# EAGLE design EP2 (EAGLE 9.0.1)
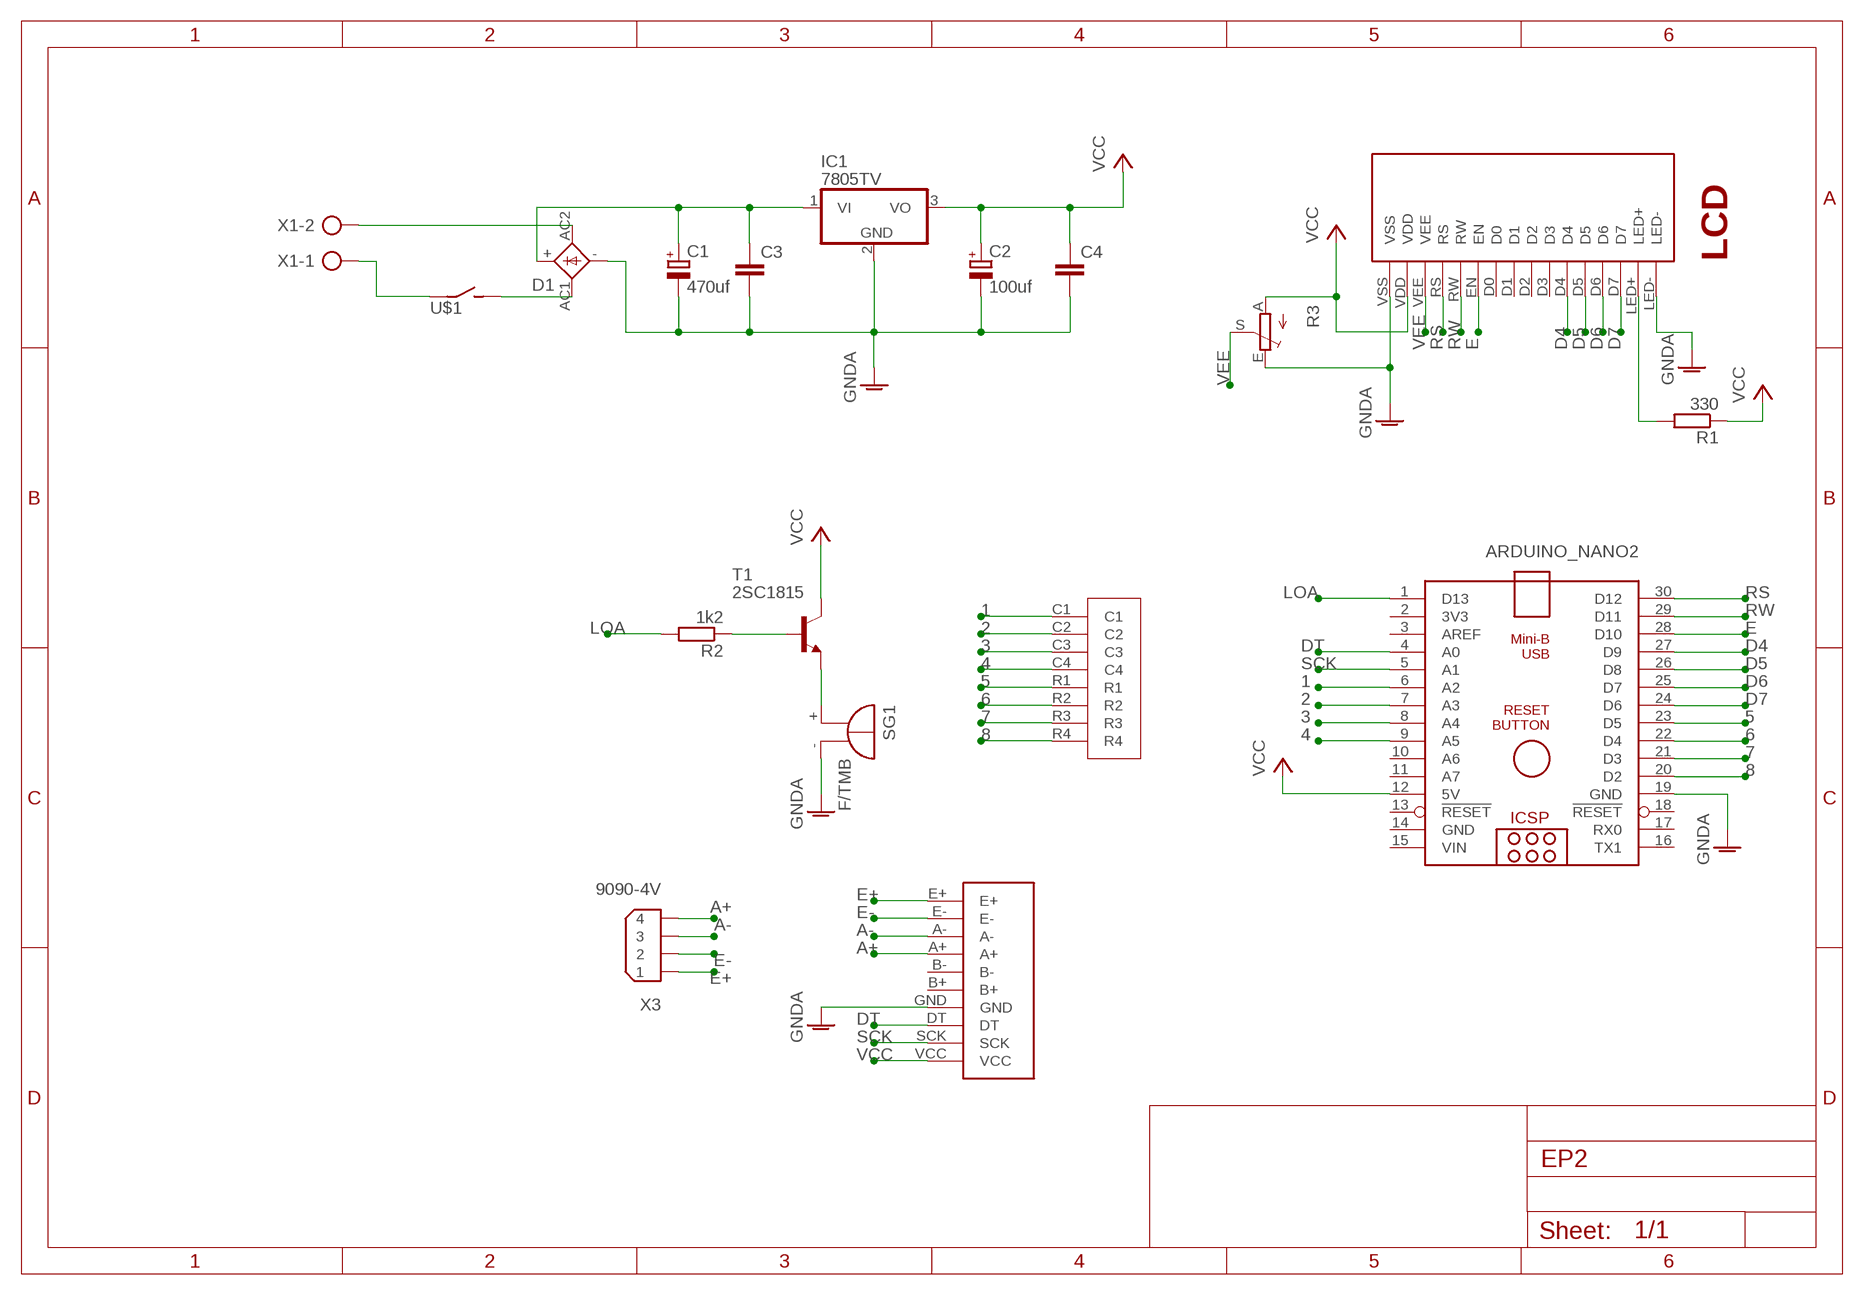
[diagram p0: schematic, sheet 1]

## Parts
ARDUINO_NANO2  ARDUINO_NANO  [ARDUINO_NANO]
C1  470uf  CPOL-EUE3.5-8  [E3,5-8]
C2  100uf  CPOL-EUE2-5  [E2-5]
C3  C-EU025-024X044  [C025-024X044]
C4  C-EU025-024X044  [C025-024X044]
D1  2KBP  [2KBP]
IC1  7805TV  [TO220V]
LCD  LCD20X4  [LCD20X4]
M1  MACHMAUXANH  [MACHMAUXANH]
R1  330  R-EU_0207/10  [0207/10]
R2  1k2  R-EU_0207/10  [0207/10]
R3  TRIM_EU-S64W  [S64W]
SG1  F/TMB  [F/TMB]
T1  2SC1815  [TO92-ECB]
U$1  CONG_TAC  [CONG_TAC]
U$2  MA_TRAN_PHIM  [MA_TRAN_PHIM]
X1  AK300/2  [AK300/2]
X3  9090-4V  [9090-4V]

## Nets
1: ARDUINO_NANO2.6(A2) U$2.C1
2: ARDUINO_NANO2.7(A3) U$2.C2
3: ARDUINO_NANO2.8(A4) U$2.C3
4: ARDUINO_NANO2.9(A5) U$2.C4
5: ARDUINO_NANO2.23(D5) U$2.R1
6: ARDUINO_NANO2.22(D4) U$2.R2
7: ARDUINO_NANO2.21(D3) U$2.R3
8: ARDUINO_NANO2.20(D2) U$2.R4
A+: M1.A+ X3.4
A-: M1.A- X3.3
D4: ARDUINO_NANO2.27(D9) LCD.D4
D5: ARDUINO_NANO2.26(D8) LCD.D5
D6: ARDUINO_NANO2.25(D7) LCD.D6
D7: ARDUINO_NANO2.24(D6) LCD.D7
DT: ARDUINO_NANO2.4(A0) M1.DT
E: ARDUINO_NANO2.28(D10) LCD.EN
E+: M1.E+ X3.1
E-: M1.E- X3.2
GNDA: ARDUINO_NANO2.19(GND) C1.- C2.- C3.2 C4.2 D1.- IC1.2(GND) LCD.LED- LCD.VSS M1.GND R3.E SG1.-
LOA: ARDUINO_NANO2.1(D13) R2.2
N$1: R2.1 T1.B
N$2: D1.AC2 X1.2
N$3: D1.AC1 U$1.P$2
N$4: C1.+ C3.1 D1.+ IC1.1(VI)
N$6: LCD.LED+ R1.2
N$9: SG1.+ T1.E
N$14: U$1.P$1 X1.1
RS: ARDUINO_NANO2.30(D12) LCD.RS
RW: ARDUINO_NANO2.29(D11) LCD.RW
SCK: ARDUINO_NANO2.5(A1) M1.SCK
VCC: ARDUINO_NANO2.12(5V) C2.+ C4.1 IC1.3(VO) LCD.VDD M1.VCC R1.1 R3.A T1.C
VEE: LCD.VEE R3.S
Unconnected: ARDUINO_NANO2.2(3V3) ARDUINO_NANO2.3(AREF) ARDUINO_NANO2.10(A6) ARDUINO_NANO2.11(A7) ARDUINO_NANO2.13(!RESET) ARDUINO_NANO2.16(TX1) ARDUINO_NANO2.17(RX0) ARDUINO_NANO2.18(!RESET) LCD.D0 LCD.D1 LCD.D2 LCD.D3 M1.B+ M1.B-

## Power pins joined to a net without a drawn wire
GND: ARDUINO_NANO2.14(GND)
VIN: ARDUINO_NANO2.15(VIN)

## Library data of the parts
ARDUINO_NANO2 = ArduinoNanoV30:ARDUINO_NANO: Arduino Nano V3.0 Overview: The Arduino Nano is a small, complete, and breadboard-friendly board based on the ATmega328 (Arduino Nano 3.x) or ATmega168 (Arduino Nano 2.x). It has more or less the same functionality of the Arduino Duemilanove, but in a different package. It lacks only a DC power jack, and works with a Mini-B USB cable instead of a standard one. The Nano was designed and is being produced by Gravitech. Specifications: Microcontroller Atmel ATmega168 or ATmega328 Operating Voltage (logic level) 5 V Input Voltage (recommended) 7-12 V Input Voltage (limits) 6-20 V Digital I/O Pins 14 (of which 6 provide PWM output) Analog Input Pins 8 DC Current per I/O Pin 40 mA Flash Memory 16 KB (ATmega168) or 32 KB (ATmega328) of which 2 KB used by bootloader SRAM 1 KB (ATmega168) or 2 KB (ATmega328) EEPROM 512 bytes (ATmega168) or 1 KB (ATmega328) Clock Speed 16 MHz Dimensions 0.73" x 1.70" Length 45 mm Width 18 mm Weigth 5 g Power: The Arduino Nano can be powered via the Mini-B USB connection, 6-20V unregulated external power supply (pin 30), or 5V regulated external power supply (pin 27). The power source is automatically selected to the highest voltage source. Memory: The ATmega168 has 16 KB of flash memory for storing code (of which 2 KB is used for the bootloader); the ATmega328 has 32 KB, (also with 2 KB used for the bootloader). The ATmega168 has 1 KB of SRAM and 512 bytes of EEPROM (which can be read and written with the EEPROM library); the ATmega328 has 2 KB of SRAM and 1 KB of EEPROM. Input and Output: Each of the 14 digital pins on the Nano can be used as an input or output, using pinMode(), digitalWrite(), and digitalRead() functions. They operate at 5 volts. Each pin can provide or receive a maximum of 40 mA and has an internal pull-up resistor (disconnected by default) of 20-50 kOhms. In addition, some pins have specialized functions. Visit Arduino - ArduinoBoardNano <https://www.arduino.cc/en/Main/ArduinoBoardNano>
C1 C2 = rcl:CPOL-EU: POLARIZED CAPACITOR, European symbol; SPICEPREFIX: C
C3 C4 = rcl:C-EU: CAPACITOR, European symbol; SPICEPREFIX: C
D1 = rectifier:2KBP: RECTIFIER grid 3 x 3,81 mm
IC1 = linear:78*: Positive VOLTAGE REGULATOR Source: http://cache.national.com/ds/LM/LM78L05.pdf http://www.fairchildsemi.com/ds/LM/LM7805.pdf
LCD = TUAN:LCD20X4
M1 = ArduinoNanoV30:MACHMAUXANH
R1 R2 = rcl:R-EU_: RESISTOR, European symbol; SPICEPREFIX: R
R3 = pot:TRIM_EU-: POTENTIOMETER
SG1 = buzzer:F/TMB: BUZZER Source: Buerklin; OC_FARNELL: unknown; OC_NEWARK: unknown
T1 = transistor:2SC1815: NPN EPITAXIAL TRANSISTOR Source: TOSHIBA .. 2SC1815 1.pdf
U$1 = CONG_TAC:CONG_TAC
U$2 = TUAN1:MA_TRAN_PHIM
X1 = con-ptr500:AK300/2: CONNECTOR; OC_FARNELL: unknown; OC_NEWARK: unknown
X3 = con-thomas-betts:9090-4: Disk Drive Power four position Source: Thomas & Betts Electronic Interconnects Eiropean Edition 1998; OC_FARNELL: unknown; OC_NEWARK: unknown

## Board
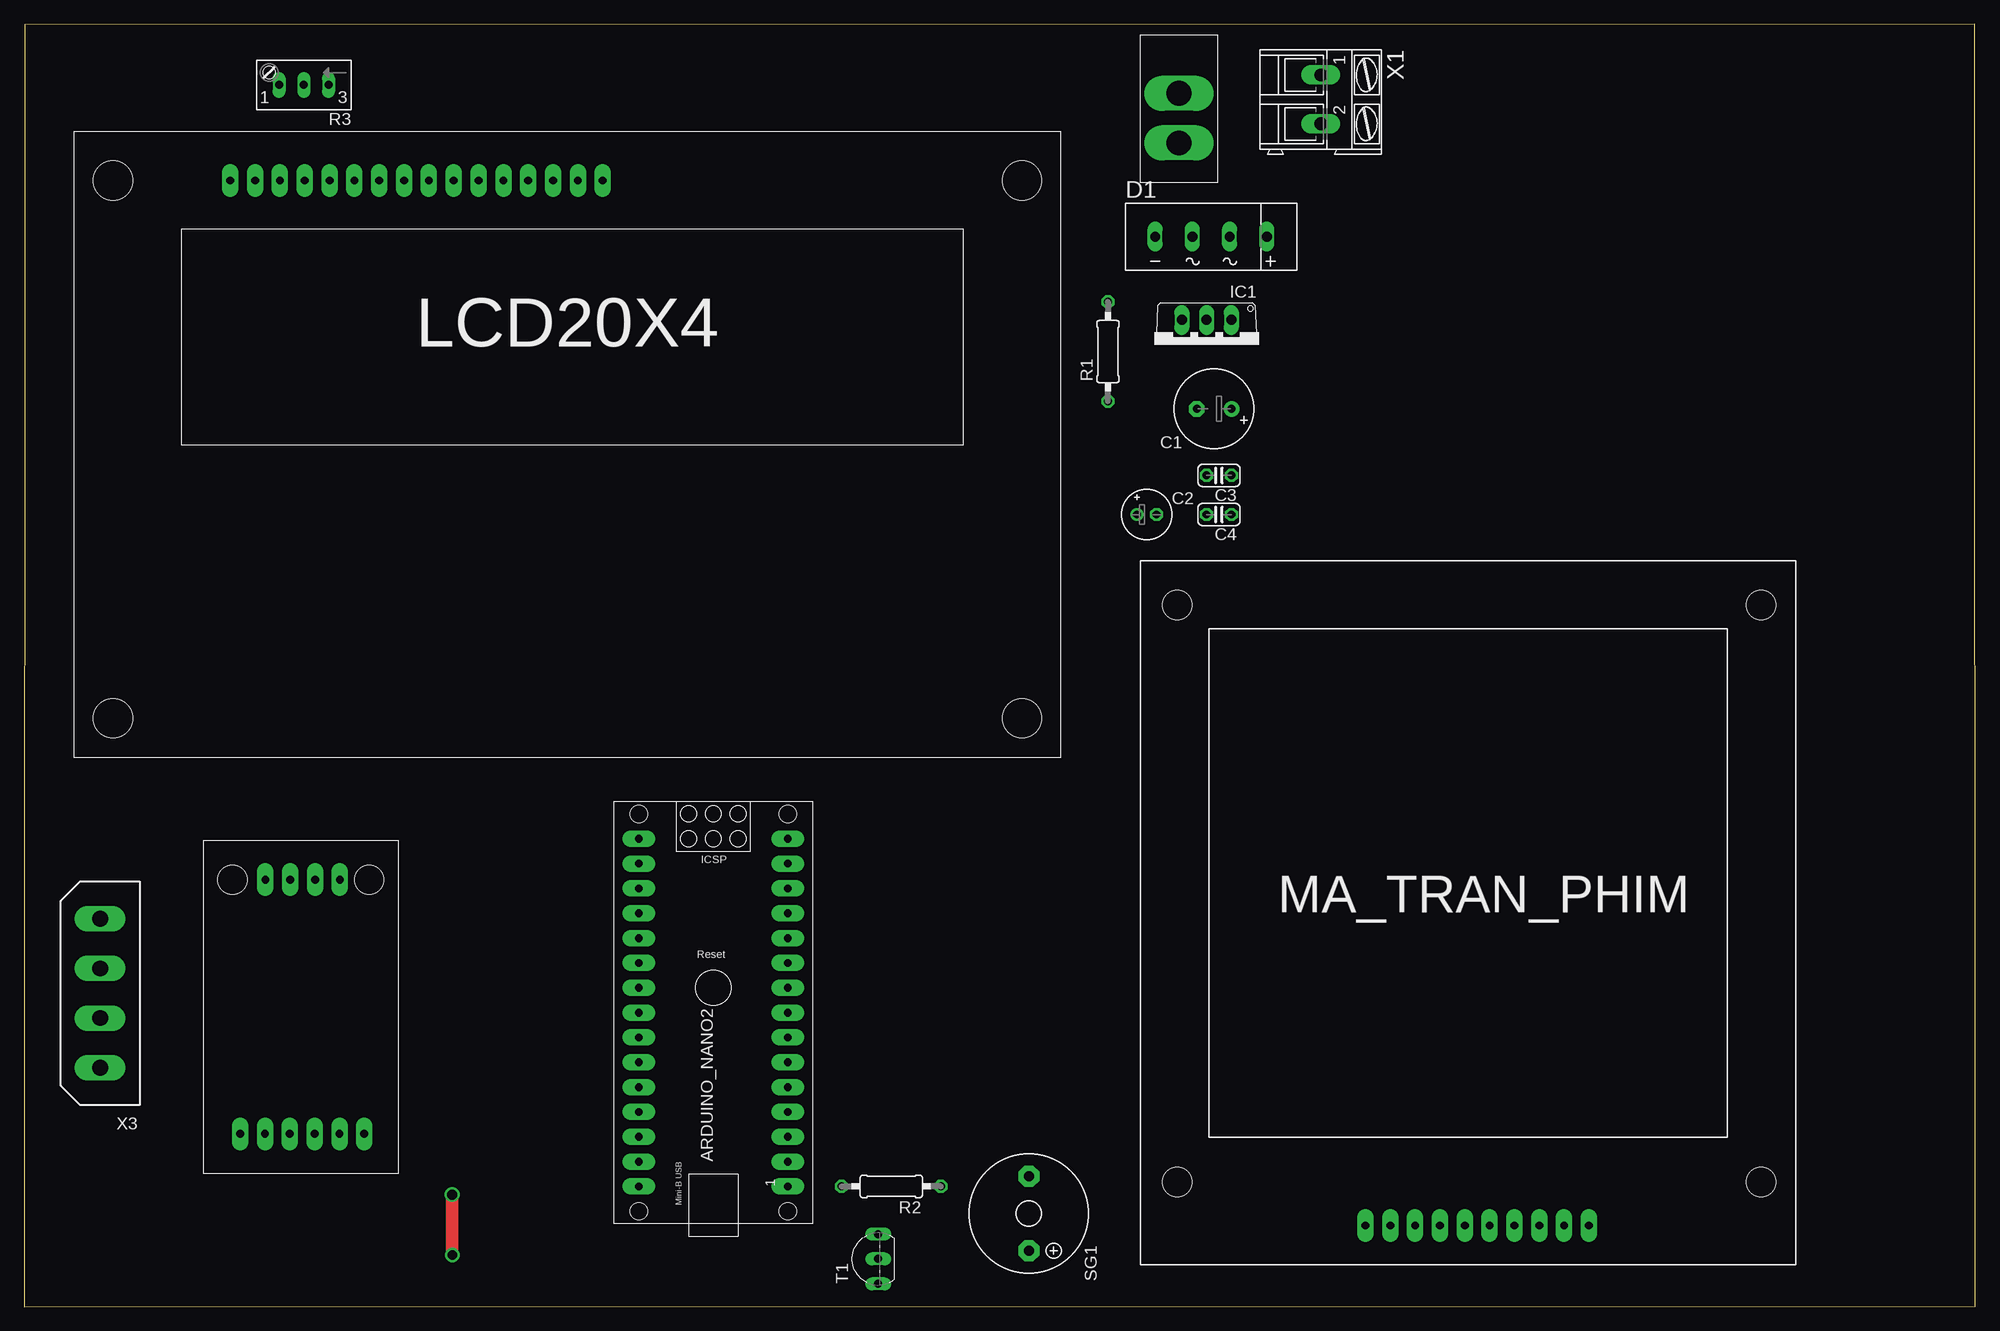
[diagram p1: board, top side]
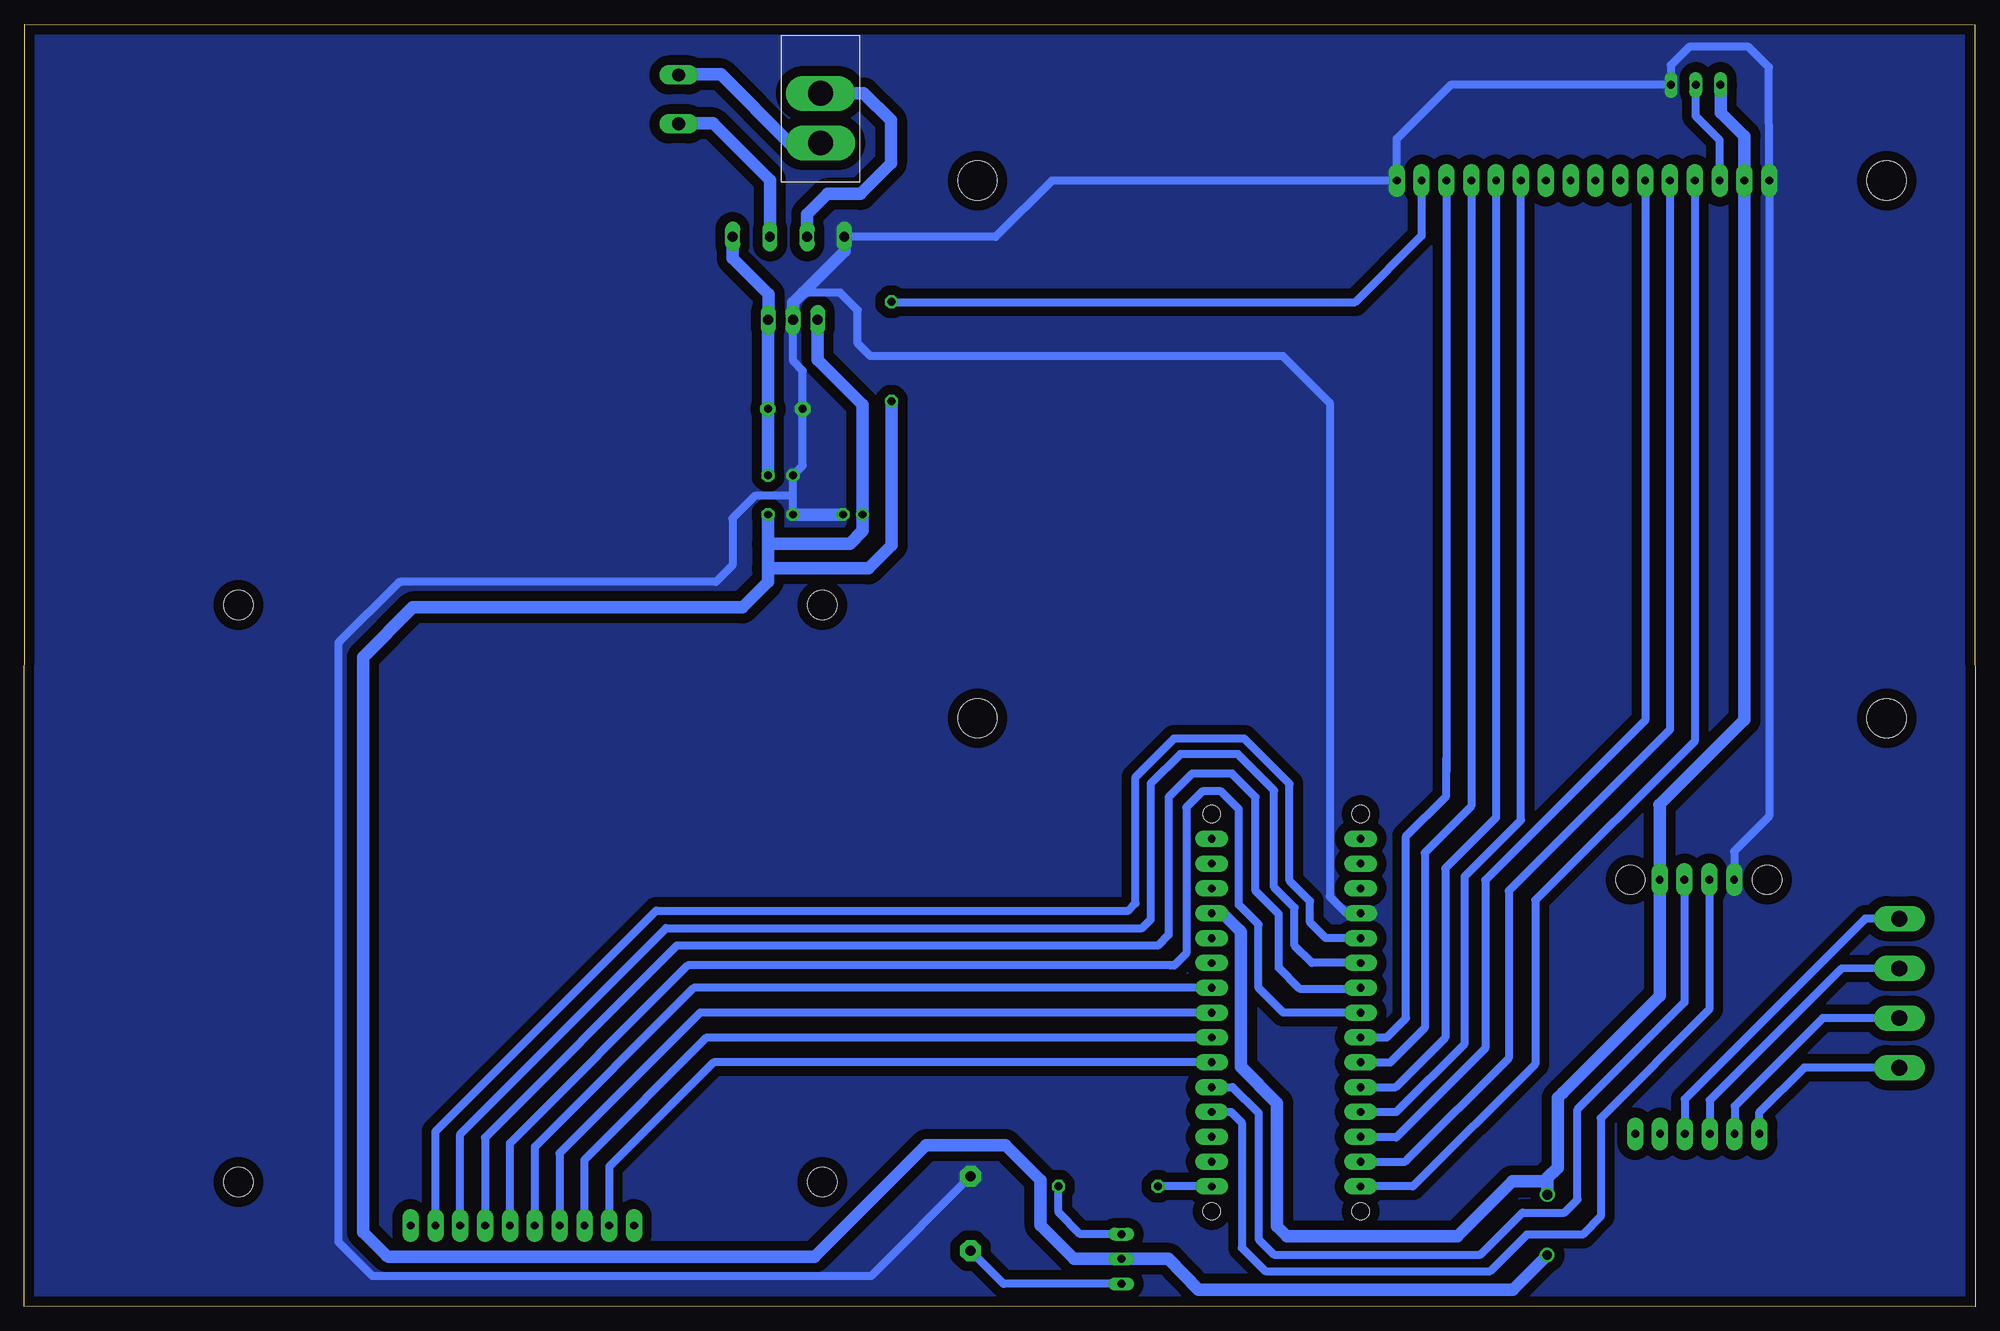
[diagram p2: board, bottom side, seen from below]

Size 199.54 x 131.12 mm. Coordinates in mm from the lower left corner, seen from the top.
Outline: 0,0 199.54,0.05 199.53,131.12 0.05,131.07 0,0
Copper layers (1*16): Top 0.035mm / dielectric 1.5mm / Bottom 0.035mm
Design rules "default *": minimum track width 30mil, minimum drill 0.8mm, track to track 30mil, track to pad 20mil, pad to pad 20mil, via to via 20mil, smd to smd 6mil, copper to edge 40mil, drill to drill 6mil, minimum pad ring 10mil, minimum via ring 8mil, stop-mask expansion 4mil, vias tented up to drill 0mil, thermal gap 10mil

### Footprints (pad centres in the part's own frame; a part is rotated, then mirrored left to right if it is on the bottom)
ARDUINO_NANO = drill 0.8 pad 1.676 long: 1 -20.32,-7.62; 2 -17.78,-7.62; 3 -15.24,-7.62; 4 -12.7,-7.62; 5 -10.16,-7.62; 6 -7.62,-7.62; 7 -5.08,-7.62; 8 -2.54,-7.62; 9 0,-7.62; 10 2.54,-7.62; 11 5.08,-7.62; 12 7.62,-7.62; 13 10.16,-7.62; 14 12.7,-7.62; 15 15.24,-7.62; 16 15.24,7.62; 17 12.7,7.62; 18 10.16,7.62; 19 7.62,7.62; 20 5.08,7.62; 21 2.54,7.62; 22 0,7.62; 23 -2.54,7.62; 24 -5.08,7.62; 25 -7.62,7.62; 26 -10.16,7.62; 27 -12.7,7.62; 28 -15.24,7.62; 29 -17.78,7.62; 30 -20.32,7.62 | hole 1.778: -22.86,-7.62; -22.86,7.62; 17.78,7.62; 17.78,-7.62
E3,5-8 = drill 0.813 pad 1.6: + -1.778,0 | drill 0.813 pad 1.6 octagon: - 1.778,0
E2-5 = drill 0.813 pad 1.27: + -1.016,0 | drill 0.813 pad 1.27 octagon: - 1.016,0
C025-024X044 = drill 0.813 octagon: 1 -1.27,0; 2 1.27,0
2KBP = drill 1.016 long: + 5.715,0; - -5.715,0; AC1 -1.905,0; AC2 1.905,0
TO220V = drill 1.016 long: 1 -2.54,-2.54; 2 0,-2.54; 3 2.54,-2.54
LCD20X4 = drill 0.8 pad 1.676 long: D0 15.24,0; D1 17.78,0; D2 20.32,0; D3 22.86,0; D4 25.4,0; D5 27.94,0; D6 30.48,0; D7 33.02,0; EN 12.7,0; LED+ 35.56,0; LED- 38.1,0; RS 7.62,0; RW 10.16,0; VDD 2.54,0; VEE 5.08,0; VSS 0,0 | hole 4: -12,0; 81,0; -12,-55; 81,-55
MACHMAUXANH = drill 0.8 pad 1.676 long: A+ 0,5.08; A- 0,7.62; B+ 0,0; B- 0,2.54; DT 26,7.58; E+ 0,12.7; E- 0,10.16; GND 26,10.12; SCK 26,5.04; VCC 26,2.5 | hole 3: 26,-0.5; 26,13.5
0207/10 = drill 0.813 octagon: 1 -5.08,0; 2 5.08,0
S64W = drill 0.813 long: A 2.54,1.27; E -2.54,1.27; S 0,1.27
F/TMB = drill 1.016 pad 2.159 octagon: + 3.81,0; - -3.81,0
TO92-ECB = drill 0.813 long: B 2.54,0; C 0,0; E -2.54,0
CONG_TAC = drill 2.54 pad 2.54 long: P$1 0,0; P$2 5.08,0
MA_TRAN_PHIM = drill 0.8 pad 1.676 long: C1 2.54,0; C2 5.08,0; C3 7.62,0; C4 10.16,0; NC1 0,0; NC2 22.86,0; R1 12.7,0; R2 15.24,0; R3 17.78,0; R4 20.32,0 | hole 3: -19.25,4.45; 40.47,4.45; -19.25,63.45; 40.47,63.45
AK300/2 = drill 1.321 long: 1 -2.515,0; 2 2.489,0
9090-4V = drill 1.6 pad 2.6 long: 1 -7.62,0; 2 -2.54,0; 3 2.54,0; 4 7.62,0

### Placement (x,y rotation side)
ARDUINO_NANO2  70.47,32.6 90 top
C1  121.7,91.8 180 top
C2  114.8,81 0 top
C3  122.2,85 180 top
C4  122.2,81 180 top
D1  121.38,109.42 0 top
IC1  120.93,98.36 180 top
LCD  21.05,115.16 0 top
M1  34.77,17.66 90 top
R1  110.83,97.67 90 top
R2  88.67,12.29 180 top
R3  28.58,126.2 180 top
SG1  102.74,9.52 270 top
T1  87.34,4.87 90 top
U$1  118.1,119 90 top
U$2  137.18,8.3 0 top
X1  132.61,123.43 270 top
X3  7.75,32.04 90 top

### Tracks (layer width: path | path; a pad name or v marks a point on that pad's centre or on a via)
1
  Bottom 0.813: ARDUINO_NANO2.6 129.02,24.98 139.72,14.3 139.72,8.35 U$2.C1
2
  Bottom 0.813: U$2.C2 142.26,15 129.73,27.52 ARDUINO_NANO2.7
3
  Bottom 0.813: ARDUINO_NANO2.8 130.4,30.06 144.8,15.67 U$2.C3
4
  Bottom 0.813: ARDUINO_NANO2.9 131.08,32.6 147.32,16.37 147.32,8.31 U$2.C4
5
  Bottom 0.813: U$2.R1 149.88,16.73 131.7,34.9 82.3,34.9 81.9,34.9 80.68,36.12 80.68,51.05 79.04,52.69 77.13,52.69 75.3,50.87 75.3,41.09 73.3,39.08 73.3,32.6 70.76,30.06 ARDUINO_NANO2.23
6
  Bottom 0.813: ARDUINO_NANO2.22 62.87,32.57 arc45 63.05,32.5 69.1,32.5 71.23,34.63 71.23,40.13 73.6,42.5 73.6,52.1 76,54.5 80.1,54.5 82.5,52.1 82.5,38 83.6,36.9 132.8,36.9 152.42,17.29 U$2.R2
7
  Bottom 0.813: U$2.R3 154.96,17.65 133.9,38.7 85.2,38.7 84.3,39.6 84.3,53.5 81.3,56.5 75.4,56.5 71.7,52.8 71.7,42.9 69.6,40.8 69.6,36.9 67.84,35.14 ARDUINO_NANO2.21
8
  Bottom 0.813: U$2.R4 157.5,17.91 134.9,40.5 86.6,40.5 85.88,41.23 85.88,54.15 81.95,58.08 74.75,58.08 70.13,53.45 70.13,43.55 68.03,41.45 68.03,39.3 66.41,37.68 ARDUINO_NANO2.20
A+
  Bottom 0.813: X3.4 11.24,39.66 29.7,21.2 29.7,17.67 M1.A+
A-
  Bottom 0.813: X3.3 13.67,34.56 27.15,21.1 27.15,17.69 M1.A-
D4
  Bottom 0.813: ARDUINO_NANO2.27 59.2,19.9 52.2,26.9 52.2,44 46.45,49.75 LCD.D4
D5
  Bottom 0.813: ARDUINO_NANO2.26 59.26,22.44 54.2,27.5 54.2,44.8 48.99,50.01 LCD.D5
D6
  Bottom 0.813: ARDUINO_NANO2.25 59.82,24.98 56.3,28.5 56.3,46.4 51.53,51.17 LCD.D6
D7
  Bottom 0.813: LCD.D7 54.07,56 | 54.07,56 54.07,54.75 | ARDUINO_NANO2.24 60.18,27.52 58.2,29.5 58.2,48.1 54.1,52.2 54.1,55.97 54.07,56
DT
  Bottom 0.813: M1.DT 27.19,30.38 38.29,19.28 38.29,9.21 40.13,7.37 45.85,7.37 49.6,3.61 72.61,3.61 75,6 75,18.8 76.1,19.9 ARDUINO_NANO2.4
E
  Bottom 0.813: LCD.EN 33.75,59.95 50.1,43.6 50.1,26.4 59.2,17.3 62.78,17.3 ARDUINO_NANO2.28
E+
  Bottom 0.813: X3.1 17.48,24.42 22.1,19.8 22.1,17.69 M1.E+
E-
  Bottom 0.813: X3.2 15.6,29.5 24.6,20.5 M1.E-
GNDA
  Bottom 0.813: LCD.VSS 21.08,126.76 23.17,128.82 29.25,128.82 31.12,126.95 | 31.12,126.95 31.12,126.79 | 59.21,115.21 LCD.LED- | 21.08,115.13 LCD.VSS | LCD.LED- 59.15,119.44 53.68,124.9 53.64,124.93 R3.E 31.13,124.95 31.12,126.95 | IC1.2 120.9,100.87 120.9,96.7 119.92,95.72 C1.- 119.92,86.01 C3.2 120.93,82.9 | SG1.- 112.9,3.17 arc45 113.08,3.1 163.8,3.1 arc45 163.97,3.17 167.4,6.6 167.4,67.8 arc45 167.33,67.97 161.27,74.03 arc45 161.1,74.1 128.8,74.1 127.1,75.8 127.1,80.6 124.8,82.9 120.93,82.9 | ARDUINO_NANO2.19 64.3,40.22 66,41.92 66,92.4 arc-45 66.07,92.47 70.8,97.2 113,97.2 114.3,98.5 114.3,101.9 116.1,103.7 119.9,103.7 | LCD.VSS 21.05,50.15 24.65,46.56 M1.GND | C4.2 120.93,82.9 | LCD.LED- 94.44,115.16 100.2,109.4 115.64,109.4 D1.-
  Bottom 1.27: D1.- 115.67,107.93 119.9,103.7 120.93,102.68 IC1.2 | C2.- C4.2
  pour Bottom (isolate 1, no thermals): 0.1,131 0.1,0.6 199.6,0.6 199.6,131
LOA
  Bottom 0.813: ARDUINO_NANO2.1 R2.2
N$1
  Bottom 0.813: T1.B 91.54,7.41 93.76,9.63 93.76,11.97 R2.1
N$2
  Bottom 1.27: D1.AC2 123.29,115.19 129.1,121 132.56,121 X1.2
N$3
  Bottom 1.27: U$1.P$2 113.68,124.08 110.9,121.3 110.9,116.9 114,113.8 117.4,113.8 119.48,111.72 D1.AC1
N$4
  Bottom 0.813: 123.5,100.87 123.48,100.89 123.4,100.97 | C3.1
  Bottom 1.27: D1.+ 127.1,107.2 123.4,103.5 123.4,100.97 IC1.1 | 123.48,100.89 C1.+ C3.1
N$6
  Bottom 0.813: LCD.LED+ 56.61,109.5 63.39,102.72 110.71,102.72 R1.2
N$9
  Bottom 0.813: T1.E 99.36,2.33 SG1.+
N$14
  Bottom 1.27: U$1.P$1 121.3,119 128.3,126 132.56,126 X1.1
RS
  Bottom 0.813: LCD.RS 28.67,57.8 45,41.57 45,24.8 57.52,12.28 ARDUINO_NANO2.30
RW
  Bottom 0.813: LCD.RW 31.21,58.99 47.7,42.5 47.7,25.4 58.1,15 58.28,14.82 ARDUINO_NANO2.29
SCK
  Bottom 0.813: M1.SCK 29.73,31.11 40.67,20.17 40.67,10.94 42,9.6 46.3,9.6 50.6,5.3 71.7,5.3 73.3,6.9 73.3,19.8 75.94,22.44 ARDUINO_NANO2.5
VCC  (via drill 1, 1 pad 1.3)
  Top 1.27: v43.74,11.45 43.74,5.84 v43.77,5.26
  Bottom 0.813: 87.22,4.99 T1.C | 162.47,5.17 arc-45 162.3,5.1 | IC1.3
  Bottom 1.27: 162.47,5.17 164.9,7.6 164.9,66.4 159.8,71.5 126.1,71.5 123.47,74.13 123.47,75.5 | ARDUINO_NANO2.12 76.99,40.22 75.27,38.5 75.27,38.47 75.1,38.3 75.1,24.5 71.4,20.8 71.4,8.2 70.38,7.18 52.96,7.18 47.33,12.8 44.1,12.8 43.74,13.16 | v43.74,11.45 43.74,13.16 | 43.74,13.16 42.7,14.2 42.7,21.34 42.17,21.87 32.27,31.77 M1.VCC 32.27,51.27 32.3,51.3 23.59,60.01 LCD.VDD 23.59,119.69 26,122.1 26,124.89 R3.A | 162.3,5.1 118.7,5.1 107.3,16.5 99.2,16.5 95.6,12.9 95.6,8.3 92.17,4.87 T1.C 82.49,4.87 79.45,1.74 47.29,1.74 v43.77,5.26 | IC1.3 118.39,96.81 113.78,92.21 C2.+ 113.78,79.32 115.1,78 123.47,78 | C4.1 123.47,78 | 123.47,78 123.47,75.5 | R1.1 110.83,77.87 113.2,75.5 123.47,75.5
VEE
  Bottom 0.813: LCD.VEE 26.13,119.3 28.58,121.75 R3.S | R3.S